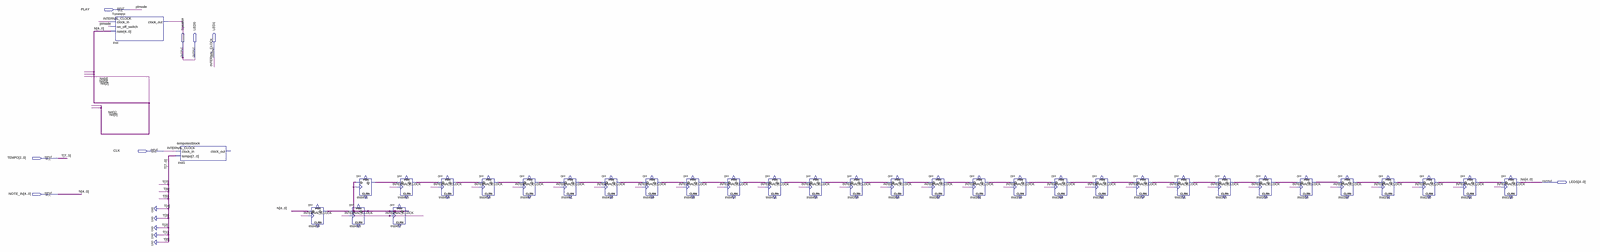
[diagram p0: schematic sheet, whole]
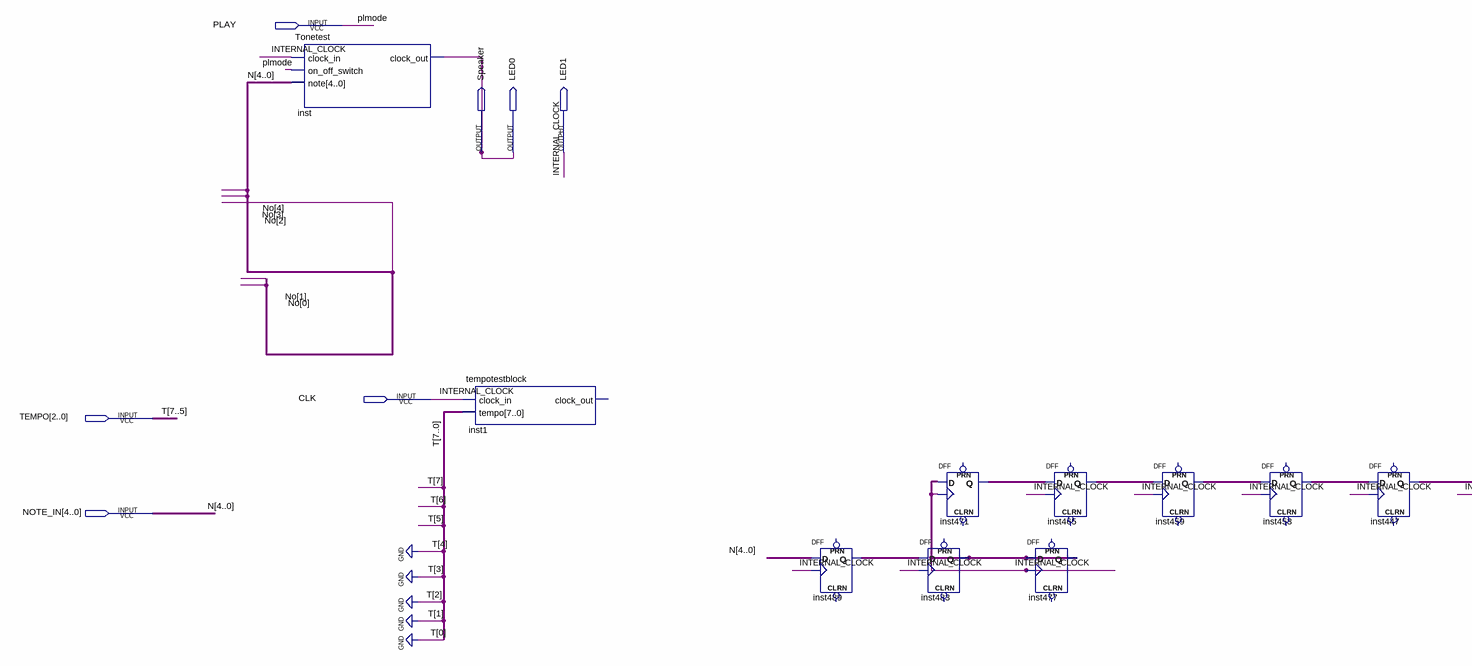
[diagram p1: schematic sheet, left part]
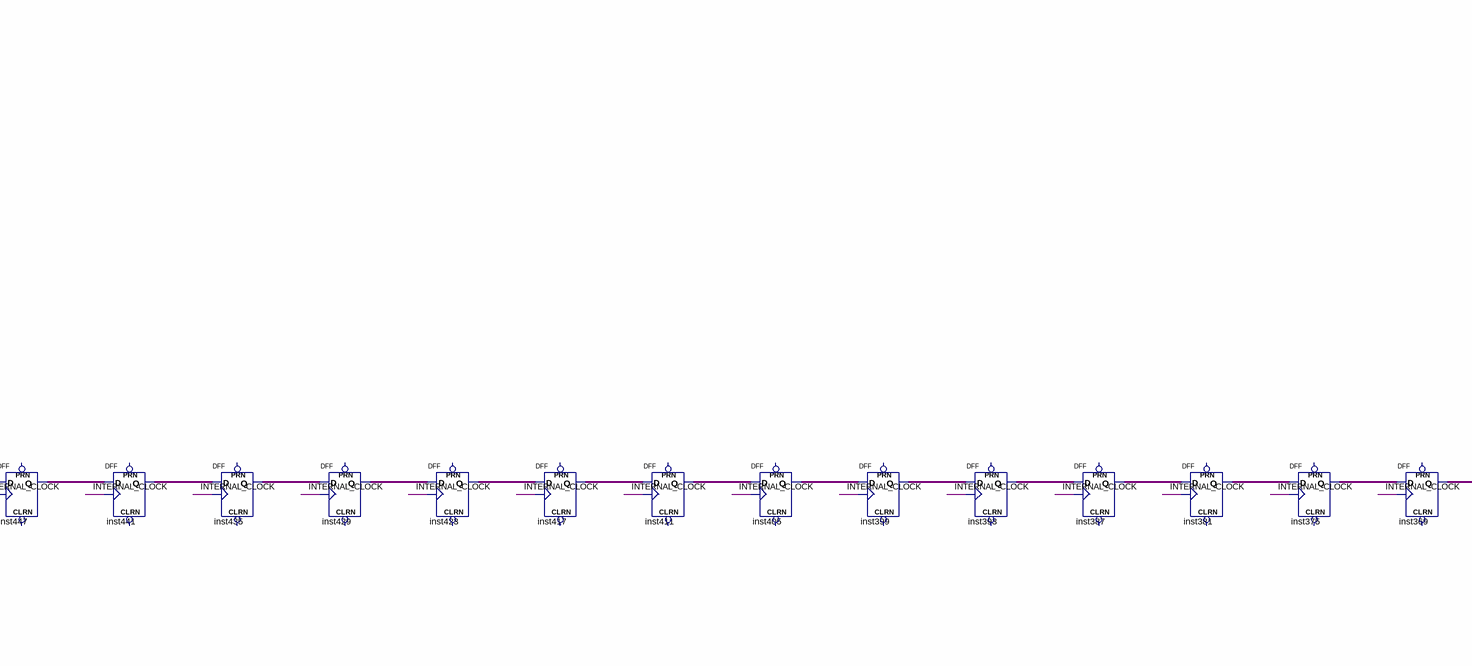
[diagram p2: schematic sheet, centre part]
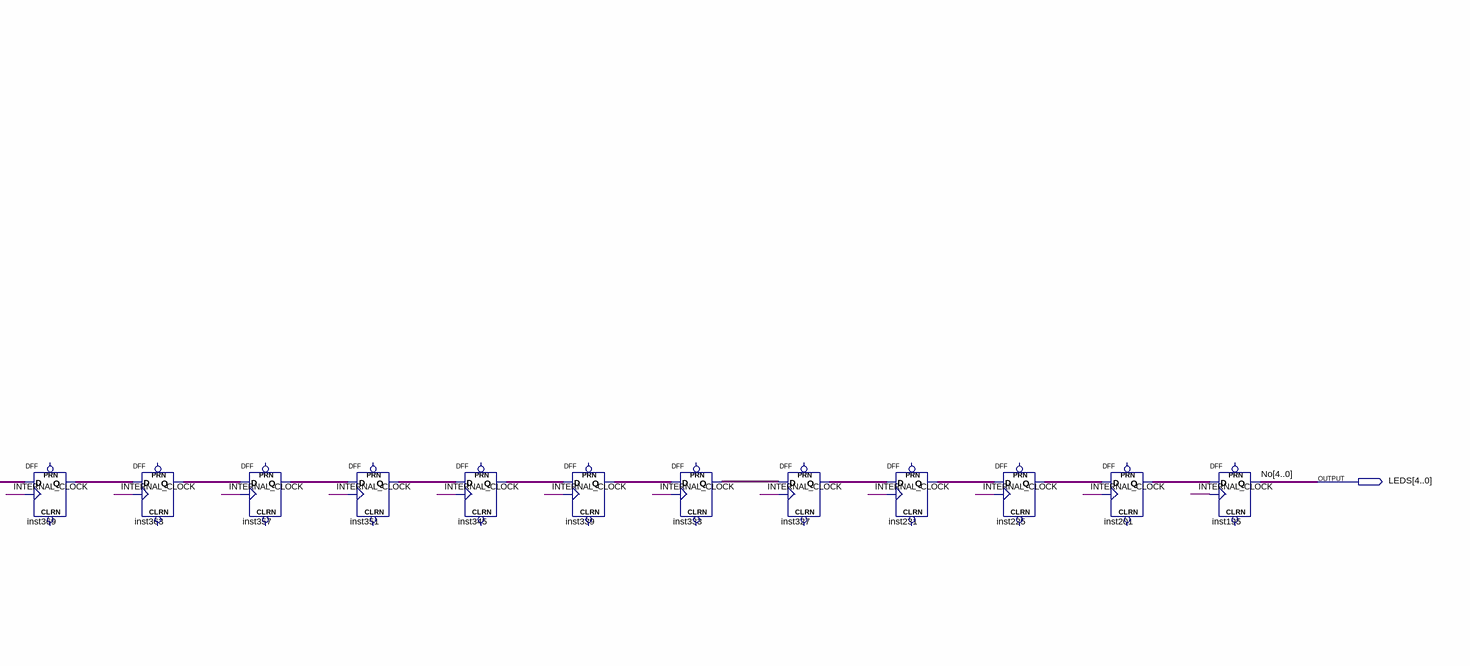
[diagram p3: schematic sheet, right part]
// Quartus schematic sound_regs.bdf as structural Verilog: 34 symbols, 8 pins
module sound_regs (
  input  PLAY,
  input  CLK,
  input  [2:0] TEMPO,
  input  [4:0] NOTE_IN,
  output Speaker,
  output LED0,
  output LED1,
  output [4:0] LEDS
);

  wire undriven;
  wire [4:0] inst201_q, inst225_q, inst231_q, inst327_q, inst333_q, inst339_q, inst345_q, inst351_q,
       inst357_q, inst363_q, inst369_q, inst375_q, inst381_q, inst387_q, inst393_q, inst399_q, inst405_q,
       inst411_q, inst417_q, inst423_q, inst429_q, inst435_q, inst441_q, inst447_q, inst453_q, inst459_q,
       inst465_q, inst471_q, inst483_q, inst489_q;

  Tonetest inst (.clock_in(CLK), .on_off_switch(PLAY), .note(NOTE_IN), .clock_out(LED0));
  tempotestblock inst1 (.clock_in(CLK), .tempo({TEMPO, {5{1'b0}}}));  // open: clock_out
  DFF inst489[4:0] (.CLK(CLK), .D(NOTE_IN), .Q(inst489_q));  // open: CLRN, PRN
  DFF inst471[4:0] (.CLK(undriven), .D(inst483_q), .Q(inst471_q));  // open: CLRN, PRN
  DFF inst483[4:0] (.CLK(CLK), .D(inst489_q), .Q(inst483_q));  // open: CLRN, PRN
  DFF inst477[4:0] (.CLK(CLK), .D(inst483_q), .Q(inst483_q));  // open: CLRN, PRN
  DFF inst465[4:0] (.CLK(CLK), .D(inst471_q), .Q(inst465_q));  // open: CLRN, PRN
  DFF inst459[4:0] (.CLK(CLK), .D(inst465_q), .Q(inst459_q));  // open: CLRN, PRN
  DFF inst453[4:0] (.CLK(CLK), .D(inst459_q), .Q(inst453_q));  // open: CLRN, PRN
  DFF inst447[4:0] (.CLK(CLK), .D(inst453_q), .Q(inst447_q));  // open: CLRN, PRN
  DFF inst441[4:0] (.CLK(CLK), .D(inst447_q), .Q(inst441_q));  // open: CLRN, PRN
  DFF inst435[4:0] (.CLK(CLK), .D(inst441_q), .Q(inst435_q));  // open: CLRN, PRN
  DFF inst429[4:0] (.CLK(CLK), .D(inst435_q), .Q(inst429_q));  // open: CLRN, PRN
  DFF inst423[4:0] (.CLK(CLK), .D(inst429_q), .Q(inst423_q));  // open: CLRN, PRN
  DFF inst417[4:0] (.CLK(CLK), .D(inst423_q), .Q(inst417_q));  // open: CLRN, PRN
  DFF inst411[4:0] (.CLK(CLK), .D(inst417_q), .Q(inst411_q));  // open: CLRN, PRN
  DFF inst405[4:0] (.CLK(CLK), .D(inst411_q), .Q(inst405_q));  // open: CLRN, PRN
  DFF inst399[4:0] (.CLK(CLK), .D(inst405_q), .Q(inst399_q));  // open: CLRN, PRN
  DFF inst393[4:0] (.CLK(CLK), .D(inst399_q), .Q(inst393_q));  // open: CLRN, PRN
  DFF inst387[4:0] (.CLK(CLK), .D(inst393_q), .Q(inst387_q));  // open: CLRN, PRN
  DFF inst381[4:0] (.CLK(CLK), .D(inst387_q), .Q(inst381_q));  // open: CLRN, PRN
  DFF inst375[4:0] (.CLK(CLK), .D(inst381_q), .Q(inst375_q));  // open: CLRN, PRN
  DFF inst369[4:0] (.CLK(CLK), .D(inst375_q), .Q(inst369_q));  // open: CLRN, PRN
  DFF inst363[4:0] (.CLK(CLK), .D(inst369_q), .Q(inst363_q));  // open: CLRN, PRN
  DFF inst357[4:0] (.CLK(CLK), .D(inst363_q), .Q(inst357_q));  // open: CLRN, PRN
  DFF inst351[4:0] (.CLK(CLK), .D(inst357_q), .Q(inst351_q));  // open: CLRN, PRN
  DFF inst345[4:0] (.CLK(CLK), .D(inst351_q), .Q(inst345_q));  // open: CLRN, PRN
  DFF inst339[4:0] (.CLK(CLK), .D(inst345_q), .Q(inst339_q));  // open: CLRN, PRN
  DFF inst333[4:0] (.CLK(CLK), .D(inst339_q), .Q(inst333_q));  // open: CLRN, PRN
  DFF inst327[4:0] (.CLK(CLK), .D(inst333_q), .Q(inst327_q));  // open: CLRN, PRN
  DFF inst231[4:0] (.CLK(CLK), .D(inst327_q), .Q(inst231_q));  // open: CLRN, PRN
  DFF inst225[4:0] (.CLK(CLK), .D(inst231_q), .Q(inst225_q));  // open: CLRN, PRN
  DFF inst201[4:0] (.CLK(CLK), .D(inst225_q), .Q(inst201_q));  // open: CLRN, PRN
  DFF inst195[4:0] (.CLK(CLK), .D(inst201_q), .Q(LEDS));  // open: CLRN, PRN

  assign LED1 = CLK;
  assign Speaker = LED0;

  // Other names for the same wires on the sheet: INTERNAL_CLOCK = CLK; N[4:0] = NOTE_IN; No[4:0] = LEDS;
  //   plmode = PLAY; T[7:5] = TEMPO
endmodule
